# EAGLE schematic LMNC VCO - v1.2 (EAGLE 9.6.2)

## Sheet 1 of 2
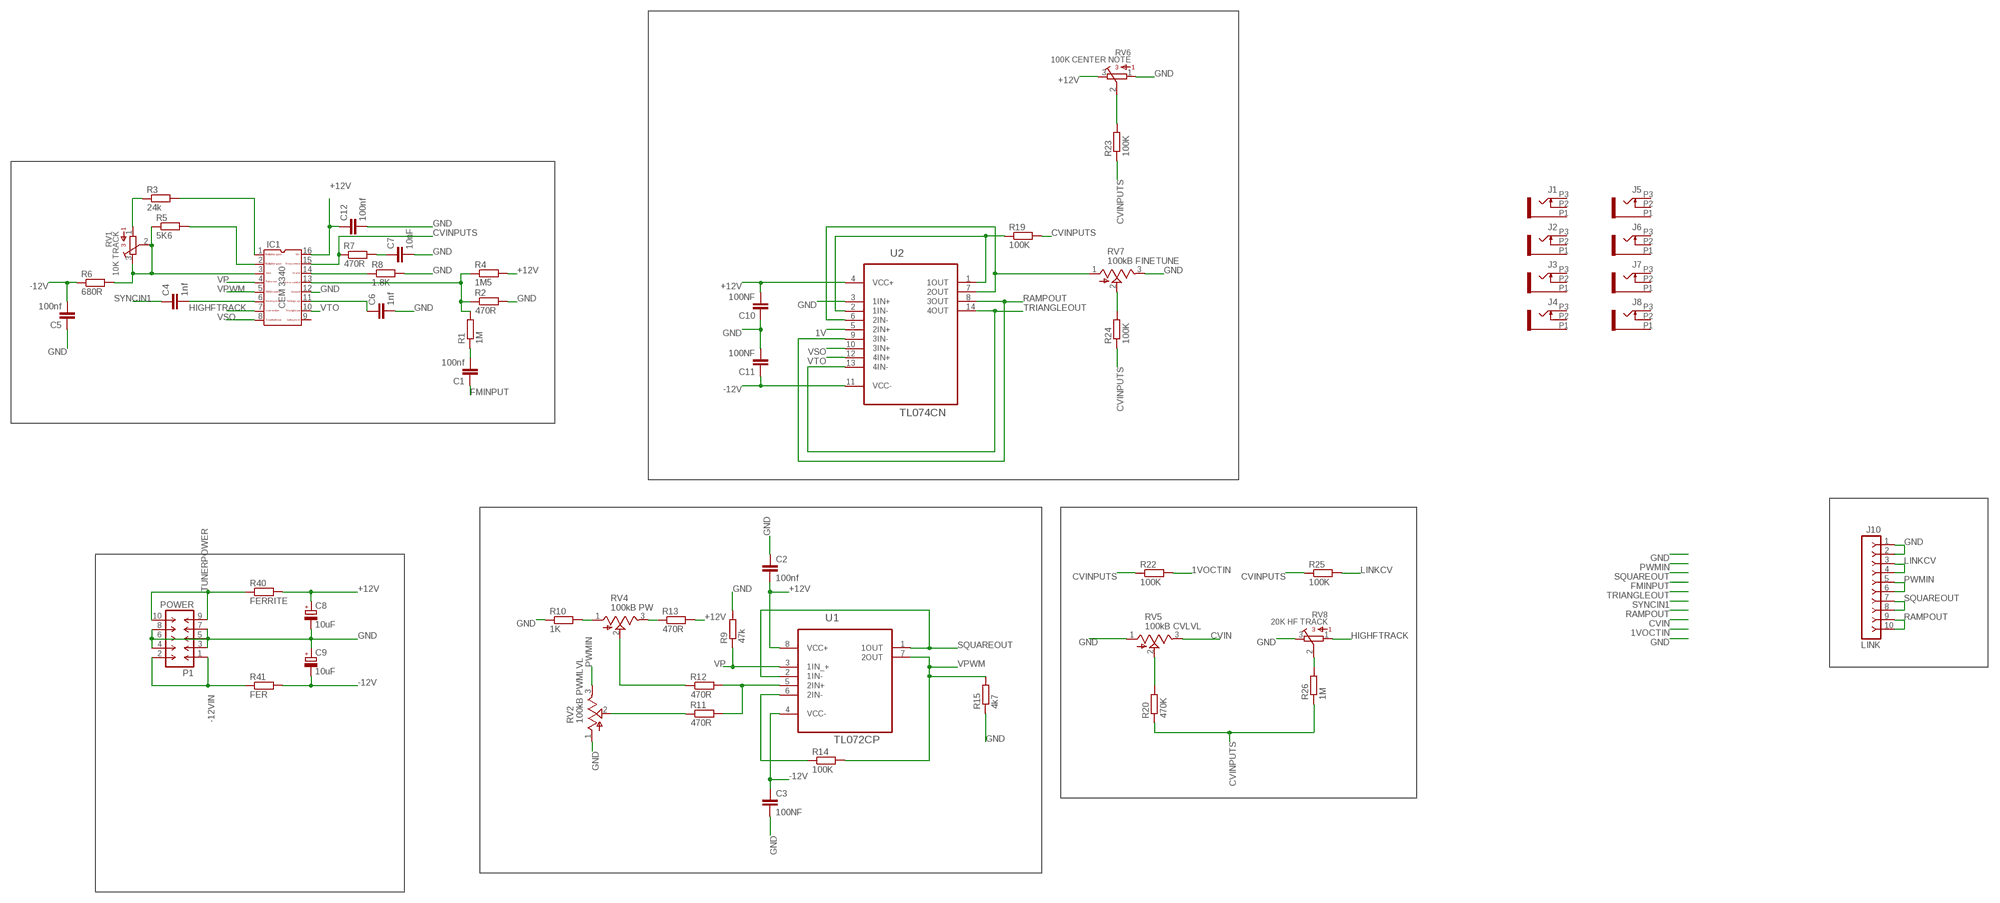
[diagram p0: schematic, sheet 1]

### Parts
C1  100nf  C-EUC0603  [C0603]
C2  100nf  C-EUC0603  [C0603]
C3  100NF  C-EUC0603  [C0603]
C4  1nf  C-EUC0603  [C0603]
C5  100nf  C-EUC0603  [C0603]
C6  1nf  C-EUC0603  [C0603]
C7  10nF  C-EUC0603  [C0603]
C8  10uF  CPOL-EU153CLV-0605  [153CLV-0605]
C9  10uF  CPOL-EU153CLV-0605  [153CLV-0605]
C10  100NF  C-EUC0603  [C0603]
C11  100NF  C-EUC0603  [C0603]
C12  100nf  C-EUC0603  [C0603]
IC1  CEM3340  [DIL16]
J1  PJ301_THONKICONNTME  [WQP_PJ_301M_TME]
J2  PJ301_THONKICONNTME  [WQP_PJ_301M_TME]
J3  PJ301_THONKICONNTME  [WQP_PJ_301M_TME]
J4  PJ301_THONKICONNTME  [WQP_PJ_301M_TME]
J5  PJ301_THONKICONNTME  [WQP_PJ_301M_TME]
J6  PJ301_THONKICONNTME  [WQP_PJ_301M_TME]
J7  PJ301_THONKICONNTME  [WQP_PJ_301M_TME]
J8  PJ301_THONKICONNTME  [WQP_PJ_301M_TME]
J10  LINK  F-1X10-SIP-100-32Y  [SIP-100-10-32Y]
P1  POWER  M-2X05-DIL-100  [DIL-100-2X05]
R1  1M  R-EU_R0603  [R0603]
R2  470R  R-EU_R0603  [R0603]
R3  24k  R-EU_R0603  [R0603]
R4  1M5  R-EU_R0603  [R0603]
R5  5K6  R-EU_R0603  [R0603]
R6  680R  R-EU_R0603  [R0603]
R7  470R  R-EU_R0603  [R0603]
R8  1.8K  R-EU_R0603  [R0603]
R9  47k  R-EU_R0603  [R0603]
R10  1K  R-EU_R0603  [R0603]
R11  470R  R-EU_R0603  [R0603]
R12  470R  R-EU_R0603  [R0603]
R13  470R  R-EU_R0603  [R0603]
R14  100K  R-EU_R0603  [R0603]
R15  4k7  R-EU_R0603  [R0603]
R19  100K  R-EU_R0603  [R0603]
R20  470K  R-EU_R0603  [R0603]
R22  100K  R-EU_R0603  [R0603]
R23  100K  R-EU_R0603  [R0603]
R24  100K  R-EU_R0603  [R0603]
R25  100K  R-EU_R0603  [R0603]
R26  1M  R-EU_R0603  [R0603]
R40  FERRITE  R-EU_R0603  [R0603]
R41  FER  R-EU_R0603  [R0603]
RV1  10K TRACK  3386-W  [3386W]
RV2  100kB PWMLVL  POT_VERTICAL  [ALPS_POT_VERTICAL]
RV4  100kB PW  POT_VERTICAL  [ALPS_POT_VERTICAL]
RV5  100kB CVLVL  POT_VERTICAL  [ALPS_POT_VERTICAL]
RV6  100K CENTER NOTE  3386-W  [3386W]
RV7  100kB FINETUNE  POT_VERTICAL  [ALPS_POT_VERTICAL]
RV8  20K HF TRACK  3386-W  [3386W]
U1  TL072CP  [DIP254P762X508-8]
U2  TL074CN  [DIP254P762X508-14]

### Nets
1V: U2.5(2IN+)
1VOCTIN: R22.2
+12V: C2.2 C8.+ C10.2 C12.1 IC1.16 R4.2 R13.2 R40.2 RV6.3 U1.8(VCC+) U2.4(VCC+)
-12V: C3.1 C5.2 C9.- C11.1 R6.1 R41.2 U1.4(VCC-) U2.11(VCC-)
-12VIN: P1.1 P1.2 R41.1
CVIN: RV5.3(B)
CVINPUTS: IC1.15 R7.1 R19.2 R20.1 R22.1 R23.1 R24.1 R25.1 R26.1
FMINPUT: C1.1
GND: C2.1 C3.2 C5.1 C6.2 C7.2 C8.- C9.+ C10.1 C11.2 C12.2 IC1.12 J10.1 J10.2 P1.3 P1.4 P1.5 P1.6 P1.7 P1.8 R2.2 R8.2 R9.2 R10.1 R15.1 RV2.1(A) RV5.1(A) RV6.1 RV7.3(B) RV8.3 U2.3(1IN+)
HIGHFTRACK: IC1.7 RV8.1
LINKCV: J10.3 J10.4 R25.2
N$1: IC1.2 R5.2
N$2: IC1.1 R3.2
N$3: IC1.3 R5.1 R6.2 RV1.2 RV1.3
N$4: R3.1 RV1.1
N$5: C7.1 R7.2
N$6: C1.2 R1.1
N$7: C4.2 IC1.6
N$8: C6.1 IC1.11
N$9: R14.1 U1.6(2IN-)
N$10: R11.2 R12.2 U1.5(2IN+)
N$11: IC1.14 R8.1
N$12: IC1.13 R1.2 R2.1 R4.1
N$13: R12.1 RV4.2(W)
N$14: R11.1 RV2.2(W)
N$15: R10.2 RV4.1(A)
N$16: R13.1 RV4.3(B)
N$17: RV7.1(A) U2.6(2IN-) U2.7(2OUT)
N$22: R24.2 RV7.2(W)
N$23: R19.1 U2.1(1OUT) U2.2(1IN-)
N$24: R23.2 RV6.2
N$29: R20.2 RV5.2(W)
N$30: R26.2 RV8.2
PWMIN: J10.5 J10.6 RV2.3(B)
RAMPOUT: J10.9 J10.10 U2.8(3OUT) U2.9(3IN-)
SQUAREOUT: J10.7 J10.8 U1.1(1OUT) U1.2(1IN-)
SYNCIN1: C4.1
TRIANGLEOUT: U2.13(4IN-) U2.14(4OUT)
TUNERPOWER: P1.9 P1.10 R40.1
VP: IC1.4 R9.1 U1.3(1IN_+)
VPWM: IC1.5 R14.2 R15.2 U1.7(2OUT)
VSO: IC1.8 U2.10(3IN+)
VTO: IC1.10 U2.12(4IN+)
Unconnected: IC1.9 J1.P1 J1.P2 J1.P3 J2.P1 J2.P2 J2.P3 J3.P1 J3.P2 J3.P3 J4.P1 J4.P2 J4.P3 J5.P1 J5.P2 J5.P3 J6.P1 J6.P2 J6.P3 J7.P1 J7.P2 J7.P3 J8.P1 J8.P2 J8.P3

## Sheet 2 of 2

## Library data of the parts
C1-C7 C10-C12 = rcl:C-EU: CAPACITOR, European symbol; SPICEPREFIX: C
C8 C9 = rcl:CPOL-EU: POLARIZED CAPACITOR, European symbol; SPICEPREFIX: C
IC1 = CEM:CEM3340: CEM 3340 VCO
J1-J8 = og-pj301:PJ301_THONKICONN
J10 = con-headers-jp:F-1X10-: FEMALE HEADER
P1 = con-headers-jp:M-2X05-: MALE HEADER
R1-R15 R19 R20 R22-R26 R40 R41 = rcl:R-EU_: RESISTOR, European symbol; SPICEPREFIX: R
RV1 RV6 RV8 = bourns:3386-: 3386 Series 3/8" Square Trimmer
RV2 RV4 RV5 RV7 = parts_aman:POT_VERTICAL
U1 = TL072CP:TL072CP: OPERATIONAL AMPLIFIER; AVAILABILITY: Unavailable; DESCRIPTION: J-FET Amplifier 2 Circuit 8-PDIP; MF: Texas Instruments; MP: TL072CP; PACKAGE: PDIP-8 ON Semiconductor; PRICE: None
U2 = TL074CN:TL074CN: LOW-NOISE JFET-INPUT OPERATIONAL AMPLIFIERS; AVAILABILITY: Unavailable; DESCRIPTION: J-FET Amplifier 4 Circuit 14-DIP; MF: STMicroelectronics; MP: TL074CN; PACKAGE: DIP-14 STMicroelectronics; PRICE: None